# Altium schematic sheet 07_Mute.SchDoc
size 513 x 386 mm
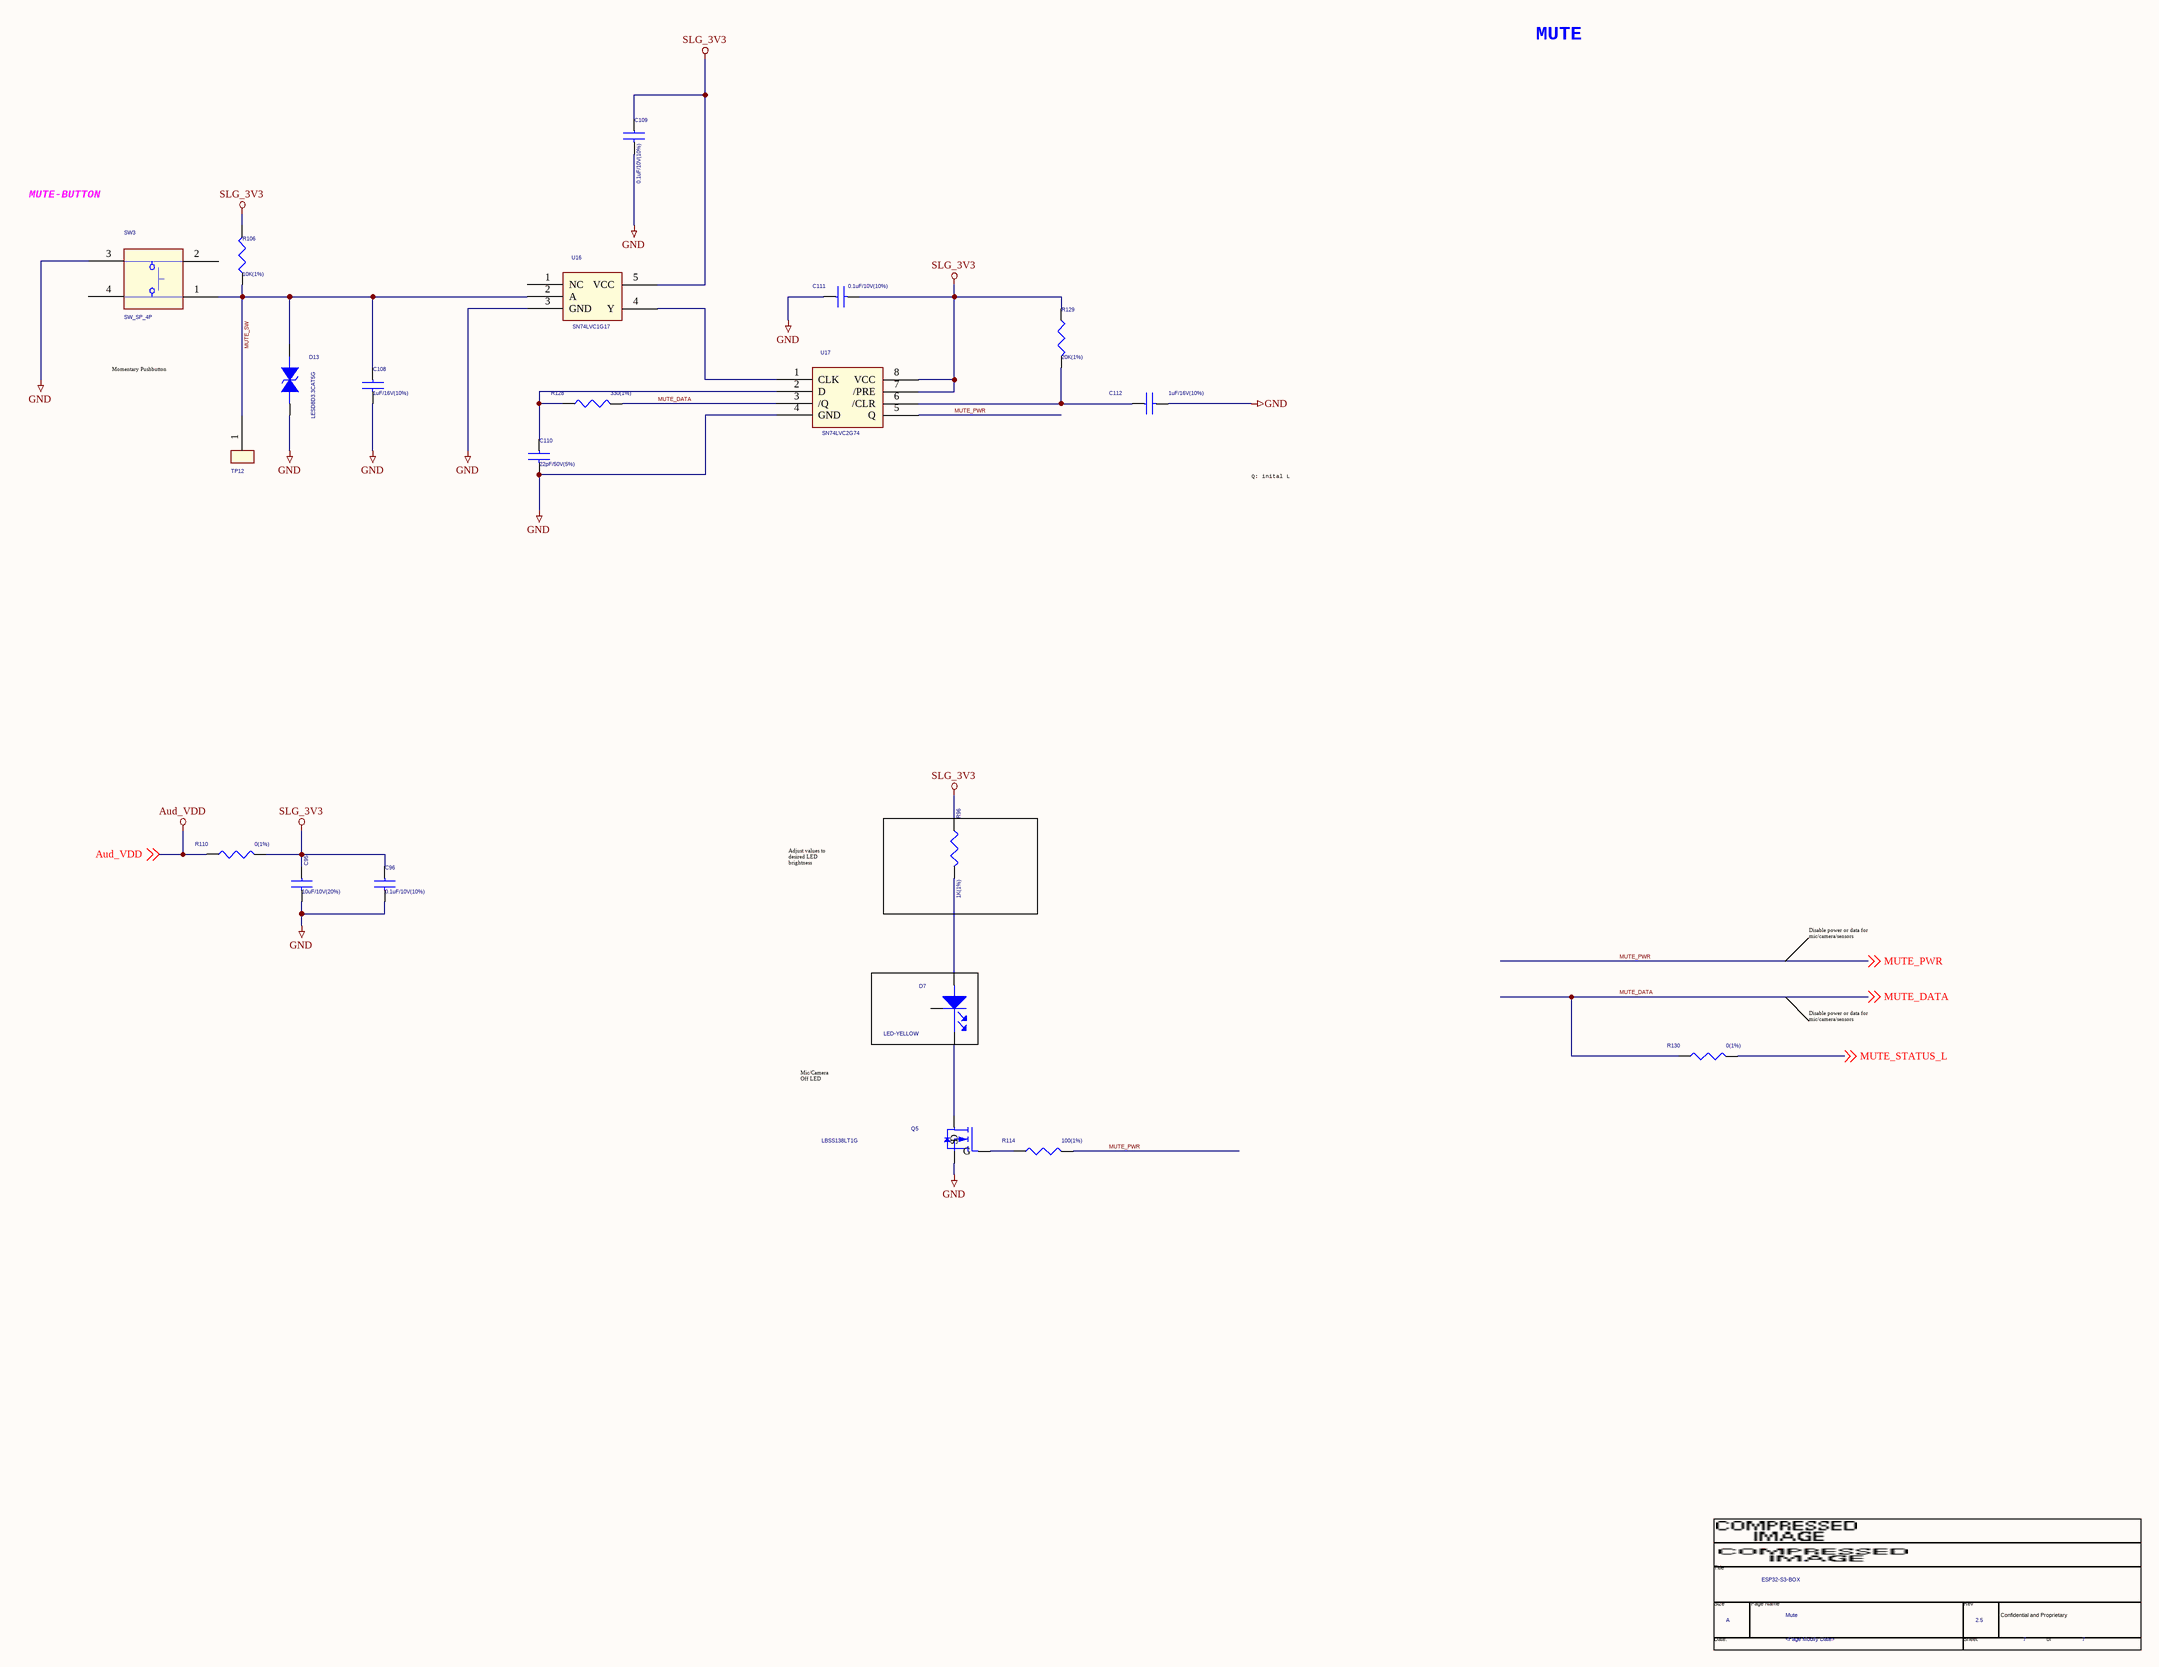
[diagram p0: 07_Mute.SchDoc]

## Parts
*  Page Modify Date: <Page Modify Date>  Page Name: Mute  Title: ESP32-S3-BOX  Page Size: A  Page Number: 7  RevCode: 2.5  (hidden comment: espTitleBlock3)  (graphical)
C95  10uF/10V(20%)  [C0402]
C96  0.1uF/10V(10%)  [C0201]
C108  1uF/16V(10%)  [C0402]
C109  0.1uF/10V(10%)  [C0402]
C110  22pF/50V(5%)  [C0402]
C111  0.1uF/10V(10%)  [C0402]
C112  1uF/16V(10%)  [C0402]
D7  LED-YELLOW  [LED_SMD1206]
D13  LESD8D3.3CAT5G  [SOD882]
Q5  LBSS138LT1G  [SOT23-3]
R96  1K(1%)  [R0201]
R106  10K(1%)  [R0201]
R110  0(1%)  [R0402]
R114  100(1%)  [R0201]
R128  330(1%)  [R0402]
R129  20K(1%)  [R0402]
R130  0(1%)  [R0402]
SW3  SW_SP_4P  [SW4-3X3P5X1P1-SMT]
TP12  TESTPOINT  [TPC_D40]  (value not drawn)
U16  SN74LVC1G17  [SOT23-5-S]
U17  SN74LVC2G74  [VSSOP8]

## Nets
Aud_VDD: R110.1 ; off-sheet Aud_VDD
GND: C95.2 C96.2 C108.2 C109.2 C110.2 C111.1 C112.2 D13.1 Q5.2(S) SW3.3 U16.3(GND) U17.4(GND)
SLG_3V3: C95.1 C96.1 C109.1 C111.2 R96.2 R106.2 R110.2 R129.1 U16.5(VCC) U17.7(/PRE) U17.8(VCC)
MUTE_DATA: R128.2 R130.1 U17.3(/Q) ; off-sheet MUTE_DATA
MUTE_PWR: R114.2 U17.5(Q) ; off-sheet MUTE_PWR
MUTE_STATUS_L: R130.2 ; off-sheet MUTE_STATUS_L
MUTE_SW: C108.1 D13.2 R106.1 SW3.1 TP12.1 U16.2(A)
NetC110_1: C110.1 R128.1 U17.2(D)
NetC112_1: C112.1 R129.2 U17.6(/CLR)
NetD7_1: D7.1 R96.1
NetD7_2: D7.2 Q5.3(D)
NetQ5_1: Q5.1(G) R114.1
NetU16_4: U16.4(Y) U17.1(CLK)

Not connected (* = marked no-connect by the designer): D7 3; SW3 2 4; U16 1(NC)

## Notes on the sheet
- MUTE
- MUTE-BUTTON
- Momentary Pushbutton
- Q: inital L
- Adjust values to
  desired LED
  brightness
- Disable power or data for
  mic/camera/sensors
- Mic/Camera
  Off LED
- (in symbol espTitleBlock3) Title; Size; Page Name; Rev; Confidential and Proprietary; Date:; Sheet; of

## Library data of the parts
* = espTitleBlock3: Doc: ESP32-S3-EYE_V1.0; OrgName: ESPRESSIF; Page Count: 7
C95 = CAPACITOR: Part Number: ES11047103700000; CODE12: ES11.04.710.3.7.0.00; Part Type: Capacitor
C96 = CAPACITOR: Part Number: ES11025103610001; CODE12: ES11.02.510.3.6.1.00; Part Type: Capacitor
C108 C112 = CAPACITOR: Part Number: ES11046104610000; CODE12: ES11.04.610.4.6.1.00; Part Type: Capacitor
C109 C111 = CAPACITOR: Part Number: ES11045103620000; CODE12: ES11.04.510.3.6.2.00; Part Type: Capacitor
C110 = CAPACITOR: Part Number: ES11041226520001; CODE12: ES11.04.122.6.5.2.00; Part Type: Capacitor
D7 = LED-BLUE
D13 = DIODE_BI_DIR: Part Number: ES31320010000000; CODE12: ES31.32.0010.00.0.0; Part Type: Diode
Q5 = NMOS: Part Number: ES31440030000000; CODE12: ES31.44.0030.00.0.0; Part Type: Transistor
R96 = RESISTOR: Part Number: ES21023100000001; CODE12: ES21.02.3100.0.00.0; Part Type: Resistor
R106 = RESISTOR: Part Number: ES21024100000001; CODE12: ES21.02.4100.0.00.0; Part Type: Resistor
R110 R130 = RESISTOR: Part Number: ES21040000000001; CODE12: ES21.04.0000.0.00.0; Part Type: Resistor
R114 = RESISTOR: Part Number: ES21022100000001; CODE12: ES21.02.2100.0.00.0; Part Type: Resistor
R128 = RESISTOR
R129 = RESISTOR: Part Number: ES21044200000001; CODE12: ES21.04.4200.0.00.0; Part Type: Resistor
SW3 = SW_SP_4P: CLASS: DISCRETE; TIME: 2004-11-29
TP12 = TESTPOINT: Part Number: ES51990010000000; CODE12: ES51.99.0010.00.00; Part Type: -